# EAGLE design sensor (EAGLE 6.5.0)
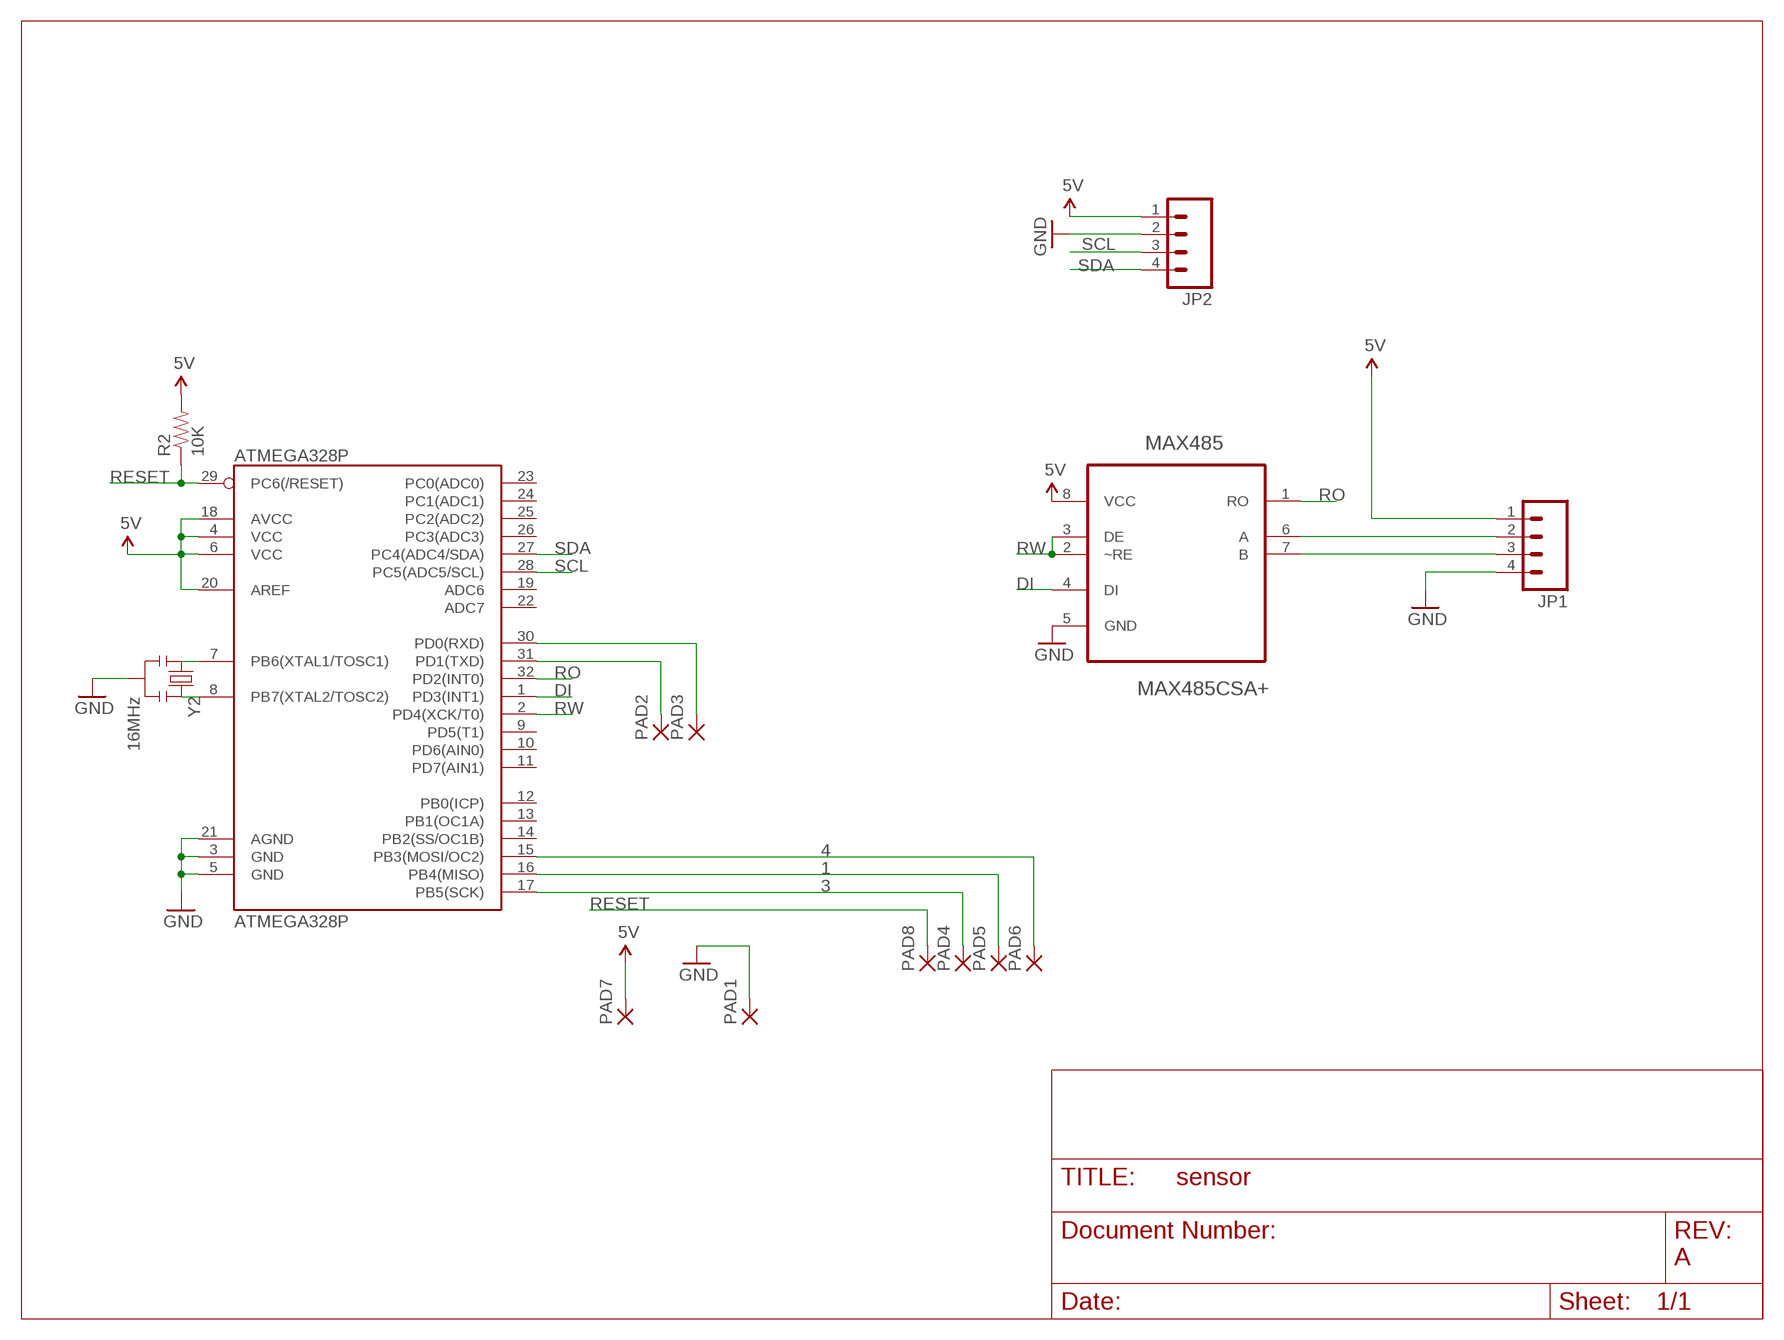
[diagram p0: schematic, sheet 1]

## Parts
ATMEGA328P  ATMEGA328P  ATMEGA328_SMT  [TQFP32-08]
JP1  M04PTH  [1X04]
JP2  M04PTH  [1X04]
MAX485  MAX485CSA+  [SOIC127P600X175-8N]
PAD1  1,6/0,9  [1,6/0,9]
PAD2  1,6/0,9  [1,6/0,9]
PAD3  1,6/0,9  [1,6/0,9]
PAD4  1,6/0,9  [1,6/0,9]
PAD5  1,6/0,9  [1,6/0,9]
PAD6  1,6/0,9  [1,6/0,9]
PAD7  1,6/0,9  [1,6/0,9]
PAD8  1,6/0,9  [1,6/0,9]
R2  10K  RESISTOR0603-RES  [0603-RES]
Y2  16MHz  RESONATOR16MHZ  [RESONATOR-SMD]

## Nets
1: ATMEGA328P.16(PB4(MISO)) PAD5.1(P)
3: ATMEGA328P.17(PB5(SCK)) PAD4.1(P)
4: ATMEGA328P.15(PB3(MOSI/OC2)) PAD6.1(P)
5V: ATMEGA328P.4(VCC) ATMEGA328P.6(VCC) ATMEGA328P.18(AVCC) ATMEGA328P.20(AREF) JP1.1 JP2.1 MAX485.8(VCC) PAD7.1(P) R2.2
DI: ATMEGA328P.1(PD3(INT1)) MAX485.4(DI)
GND: ATMEGA328P.3(GND) ATMEGA328P.5(GND) ATMEGA328P.21(AGND) JP1.4 JP2.2 MAX485.5(GND) PAD1.1(P) Y2.2
N$1: ATMEGA328P.7(PB6(XTAL1/TOSC1)) Y2.1
N$2: ATMEGA328P.8(PB7(XTAL2/TOSC2)) Y2.3
N$6: ATMEGA328P.30(PD0(RXD)) PAD3.1(P)
N$7: JP1.2 MAX485.6(A)
N$8: JP1.3 MAX485.7(B)
N$9: ATMEGA328P.31(PD1(TXD)) PAD2.1(P)
RESET: ATMEGA328P.29(PC6(/RESET)) PAD8.1(P) R2.1
RO: ATMEGA328P.32(PD2(INT0)) MAX485.1(RO)
RW: ATMEGA328P.2(PD4(XCK/T0)) MAX485.2(~RE) MAX485.3(DE)
SCL: ATMEGA328P.28(PC5(ADC5/SCL)) JP2.3
SDA: ATMEGA328P.27(PC4(ADC4/SDA)) JP2.4
Unconnected: ATMEGA328P.9(PD5(T1)) ATMEGA328P.10(PD6(AIN0)) ATMEGA328P.11(PD7(AIN1)) ATMEGA328P.12(PB0(ICP)) ATMEGA328P.13(PB1(OC1A)) ATMEGA328P.14(PB2(SS/OC1B)) ATMEGA328P.19(ADC6) ATMEGA328P.22(ADC7) ATMEGA328P.23(PC0(ADC0)) ATMEGA328P.24(PC1(ADC1)) ATMEGA328P.25(PC2(ADC2)) ATMEGA328P.26(PC3(ADC3))

## Notes on the sheet
- A

## Library data of the parts
ATMEGA328P = SparkFun-DigitalIC:ATMEGA328_SMT: 32-Pin Atmega328 part Commonly used on Arduino compatible boards Available in QFP and QFN packages TQFP is IC-09069 QFN is non-stock; PROD_ID: IC-09069
JP1 JP2 = SparkFun-Connectors:M04: Header 4 Standard 4-pin 0.1" header. Use with straight break away headers (SKU : PRT-00116), right angle break away headers (PRT-00553), swiss pins (PRT-00743), machine pins (PRT-00117), and female headers (PRT-00115). Molex polarized connector foot print use with SKU : PRT-08231 with associated crimp pins and housings. 1MM SMD Version SKU: PRT-10208
MAX485 = Maxim_By_element14_Batch_1:MAX485CSA+: ±15kV ESD-Protected, Slew-Rate-Limited, Low-Power, RS-485/RS-422 Transceivers; MPN: MAX485CSA+; OC_FARNELL: 9725954; OC_NEWARK: 68K4795; PACKAGE: SOIC-8; SUPPLIER: Maxim
PAD1-PAD8 = wirepad:1,6/0,9: THROUGH-HOLE PAD
R2 = SparkFun-Passives:RESISTOR: Resistor Basic schematic elements and footprints for 0603, 1206, and PTH resistors.
Y2 = SparkFun-FreqCtrl:RESONATOR: Resonator Small SMD resonator. Used, eg, on the Arduino Pro/ Pro Mini boards. 8MHz- XTAL-08895 16MHz- XTAL-08900; PROD_ID: XTAL-08900

## Board
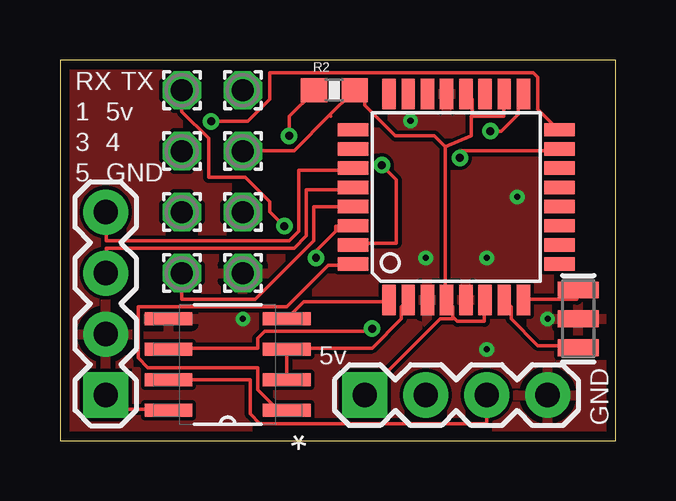
[diagram p1: board, top side]
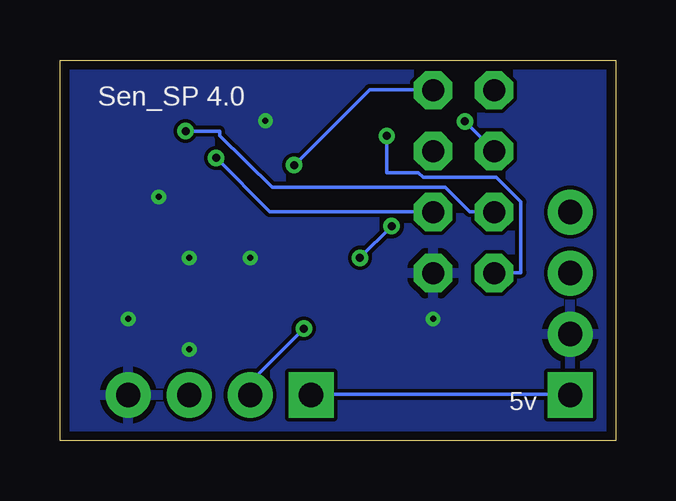
[diagram p2: board, bottom side, seen from below]

Size 23.16 x 15.87 mm. Coordinates in mm from the lower left corner, seen from the top.
Outline: 0,0 23.16,0 23.16,15.87 0,15.87 0,0
Copper layers (1*16): Top 0.0356mm / dielectric 1.5011mm / Bottom 0.0356mm
Design rules "LaenPCBOrder": minimum track width 6mil, minimum drill 13mil, track to track 6mil, track to pad 6mil, pad to pad 6mil, via to via 6mil, smd to smd 6mil, copper to edge 15mil, drill to drill 6mil, minimum pad ring 7mil, minimum via ring 7mil, stop-mask expansion 3mil, vias tented up to drill 0mil, thermal gap 10mil

### Footprints (pad centres in the part's own frame; a part is rotated, then mirrored left to right if it is on the bottom)
TQFP32-08 = smd 1.27 x 0.559: 1 -4.293,2.8; 2 -4.293,2; 3 -4.293,1.2; 4 -4.293,0.4; 5 -4.293,-0.4; 6 -4.293,-1.2; 7 -4.293,-2; 8 -4.293,-2.8; 17 4.293,-2.8; 18 4.293,-2; 19 4.293,-1.2; 20 4.293,-0.4; 21 4.293,0.4; 22 4.293,1.2; 23 4.293,2; 24 4.293,2.8 | smd 0.559 x 1.27: 9 -2.8,-4.293; 10 -2,-4.293; 11 -1.2,-4.293; 12 -0.4,-4.293; 13 0.4,-4.293; 14 1.2,-4.293; 15 2,-4.293; 16 2.8,-4.293; 25 2.8,4.293; 26 2,4.293; 27 1.2,4.293; 28 0.4,4.293; 29 -0.4,4.293; 30 -1.2,4.293; 31 -2,4.293; 32 -2.8,4.293
1X04 = drill 1.016 pad 1.88 square: 1 0,0 | drill 1.016 pad 1.88: 2 2.54,0; 3 5.08,0; 4 7.62,0
SOIC127P600X175-8N = smd 1.981 x 0.533: 1 -2.464,1.905; 2 -2.464,0.635; 3 -2.464,-0.635; 4 -2.464,-1.905; 5 2.464,-1.905; 6 2.464,-0.635; 7 2.464,0.635; 8 2.464,1.905
1,6/0,9 = drill 0.914 pad 1.6 octagon: 1 0,0
0603-RES = smd 1.1 x 1: 1 -0.85,0; 2 0.85,0
RESONATOR-SMD = smd 0.7 x 1.7: 1 -1.2,0; 2 0,0; 3 1.2,0

### Placement (x,y rotation side)
ATMEGA328P  16.51,10.16 90 top
JP1  12.7,1.91 0 top
JP2  1.91,1.91 90 top
MAX485  6.99,3.17 180 top
PAD1  7.62,6.99 0 top
PAD2  7.62,14.61 0 top
PAD3  5.08,14.61 0 top
PAD4  5.08,9.53 0 top
PAD5  5.08,12.06 0 top
PAD6  7.62,9.53 0 top
PAD7  7.62,12.06 0 top
PAD8  5.08,6.99 0 top
R2  11.43,14.61 0 top
Y2  21.59,5.08 90 top

### Tracks (layer width: path | path; a pad name or v marks a point on that pad's centre or on a via)
1  (via drill 0.33)
  Top 0.152: v6.3,13.31 7.82,13.31 8.74,14.22 8.74,15.34 19.71,15.34 19.91,15.14 19.91,13.82 20.73,13.01 ATMEGA328P.16
  Bottom 0.152: v6.3,13.31 5.08,12.09 PAD5.1
3  (via drill 0.33)
  Top 0.152: v17.93,12.9 18.39,12.9 19.1,13.61 19.1,14.22 19.3,14.43 ATMEGA328P.17
  Bottom 0.152: v17.93,12.9 16.51,12.9 16.51,12.7 14.33,10.57 7.11,10.57 6.1,9.55 5.08,9.55 PAD4.1
4  (via drill 0.33)
  Top 0.152: v16.66,11.79 16.66,12.09 20.73,12.09 ATMEGA328P.15
  Bottom 0.152: v16.66,11.79 14.43,9.55 7.62,9.55 PAD6.1
5V
  Top 0.152: 17.37,13.51 17.22,13.66 | 17.22,13.66 17.17,13.72 17.17,14.22 16.97,14.43 ATMEGA328P.20 | 17.73,13.51 18.49,13.51 18.49,14.43 ATMEGA328P.18 | 17.73,13.51 17.37,13.51 | 11.23,13.56 9.75,12.09 7.62,12.09 PAD7.1 | 11.23,13.56 12.19,14.53 R2.2 12.7,14.19 12.7,13.97 13.97,12.7 15.6,12.7 16.05,12.24 | 17.73,13.51 17.83,13.61 17.17,13.61 17.22,13.66 | 16.05,12.24 17.14,12.7 17.14,13.51 17.37,13.51 | 11.28,13.51 11.23,13.56 | MAX485.8 4.47,1.32 1.93,1.32 1.93,1.83 JP2.1 | 16.41,5.13 16.56,4.98 17.68,4.98 17.68,5.79 ATMEGA328P.6 | 16.41,5.13 16.36,5.18 16.36,5.59 16.15,5.79 ATMEGA328P.4 16.05,5.89 16.05,12.24 | 16.41,5.13 16.36,5.08 15.85,5.08 12.7,1.93 JP1.1
  Bottom 0.152: JP2.1 1.93,1.93 12.7,1.93 JP1.1
DI
  Top 0.152: MAX485.4 10.16,5.79 13.61,5.79 ATMEGA328P.1
GND  (via drill 0.25)
  other vias: 7.62,5.08 15.24,7.62 14.61,13.34 19.05,10.16 17.78,7.62 17.78,3.81 20.32,5.08
  pour Top: -1.27,19.68 27.94,19.68 27.94,-1.91 -1.27,-1.91
  pour Bottom: -1.27,19.68 27.94,19.68 27.94,-1.91 -1.27,-1.91
N$1
  Top 0.152: ATMEGA328P.7 18.59,5.79 18.8,5.59 18.8,5.08 19.91,3.96 21.54,3.96 Y2.1
N$2
  Top 0.152: ATMEGA328P.8 19.41,5.89 21.54,5.89 21.54,6.2 Y2.3
N$6  (via drill 0.33)
  Top 0.152: v10.67,7.62 10.67,7.92 11.48,8.74 11.48,8.94 12.19,8.94 ATMEGA328P.30 | v9.35,8.94 8.74,9.55 8.74,9.96 7.72,10.97 6.2,10.97 6.2,12.6 5.08,13.72 PAD3.1
  Bottom 0.152: v9.35,8.94 v10.67,7.62
N$7  (via drill 0.33)
  Top 0.152: v13.01,4.67 13.01,4.57 8.53,4.57 8.23,4.27 8.23,3.86 4.57,3.86 MAX485.6
  Bottom 0.152: v13.01,4.67 15.24,2.44 JP1.2
N$8
  Top 0.152: MAX485.7 7.92,2.54 7.92,1.12 8.33,0.71 17.78,0.71 JP1.3
N$9  (via drill 0.33)
  Top 0.152: v13.41,11.48 14.02,10.87 14.02,8.23 12.29,8.23 ATMEGA328P.31
  Bottom 0.152: v13.41,11.48 10.26,14.63 7.62,14.63 PAD2.1
RESET  (via drill 0.33)
  Top 0.152: v9.55,12.7 9.55,13.51 10.57,14.53 R2.1 | PAD8.1 5.08,5.89 8.13,5.89 10.57,8.33 10.57,9.75 12.19,9.75 ATMEGA328P.29
  Bottom 0.152: v9.55,12.7 9.55,11.18 8.23,11.18 8.03,10.97 4.98,10.97 3.96,9.96 3.96,7.01 5.08,7.01 PAD8.1
RO
  Top 0.152: ATMEGA328P.32 12.19,7.32 11.18,7.32 9.45,5.59 3.25,5.59 3.25,3.45 3.66,3.05 8.23,3.05 8.23,2.13 9.04,1.32 9.45,1.32 MAX485.1
RW
  Top 0.152: ATMEGA328P.2 14.43,5.79 14.22,5.59 14.22,5.08 13.01,3.86 9.45,3.86 MAX485.3 MAX485.2
SCL
  Top 0.152: ATMEGA328P.28 12.19,10.46 10.26,10.46 10.26,8.53 9.75,8.03 1.93,8.03 1.93,7.01 JP2.3
SDA
  Top 0.152: ATMEGA328P.27 12.19,11.28 9.96,11.28 9.96,8.74 9.55,8.33 1.93,8.33 1.93,9.45 JP2.4

### Text on the board
bPlace: Sen_SP 4.0
tNames: RX | TX | 1 | 5v | 3 | 4 | 5 | GND | 5v | GND
bNames: 5v